# EAGLE design Power Dist MCU (EAGLE 7.2.0)
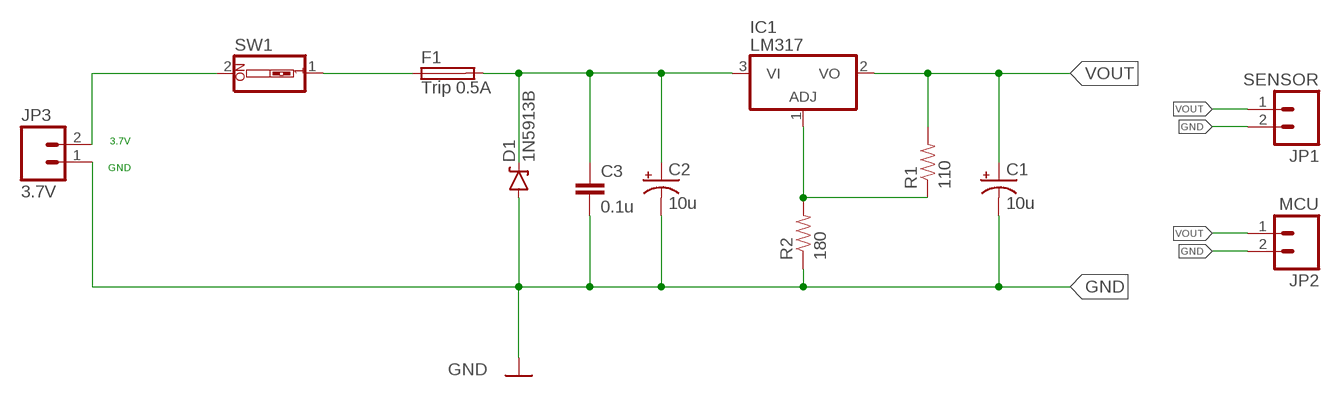
[diagram p0: schematic, sheet 1]

## Parts
C1  10u  CAP_POLPTH2  [CPOL-RADIAL-10UF-25V]
C2  10u  CAP_POLPTH2  [CPOL-RADIAL-10UF-25V]
C3  0.1u  CAPPTH  [CAP-PTH-SMALL]
D1  1N5913B  DIODE-ZENER  [DIODE-BZT52]
F1  Trip 0.5A  PICOFUSE  [PICOFUSE]
IC1  LM317  317T  [TO220H]
JP1  SENSOR  M02PTH  [1X02]
JP2  MCU  M02PTH  [1X02]
JP3  3.7V  M02JST-PTH-2  [JST-2-PTH]
R1  110  RESISTORPTH-1/4W  [AXIAL-0.4]
R2  180  RESISTORPTH-1/4W  [AXIAL-0.4]
SW1  SW_DIP-1  [EDG-01]

## Nets
GND: C1.2(-) C2.2(-) C3.2 D1.A JP1.2 JP2.2 JP3.1 R2.P$1
N$1: F1.1 SW1.1
N$2: JP3.2 SW1.2
N$4: IC1.1(ADJ) R1.P$1 R2.P$2
N$5: C2.1(+) C3.1 D1.C F1.2 IC1.3(VI)
VOUT: C1.1(+) IC1.2(VO) JP1.1 JP2.1 R1.P$2

## Notes on the sheet
- 3.7V
- GND

## Library data of the parts
C1 C2 = SparkFun-Capacitors:CAP_POL: Capacitor Polarized These are standard SMD and PTH capacitors. Normally 10uF, 47uF, and 100uF in electrolytic and tantalum varieties. Always verify the external diameter of the through hole cap, it varies with capacity, voltage, and manufacturer. The EIA devices should be standard.
C3 = SparkFun-Capacitors:CAP: Capacitor Standard 0603 ceramic capacitor, and 0.1" leaded capacitor.
D1 = SparkFun-DiscreteSemi:DIODE-ZENER: Zener Diode Production Part - 8199 3.4V Zener Voltage; PROD-ID: DIO-08199; VALUE: BZT52
F1 = fuse:PICOFUSE: PICOFUSE 19275, Wickmann; OC_FARNELL: unknown; OC_NEWARK: unknown
IC1 = linear:*317: Positive VOLTAGE REGULATOR
JP1 JP2 = SparkFun-Connectors:M02: Standard 2-pin 0.1" header. Use with - straight break away headers ( PRT-00116) - right angle break away headers (PRT-00553) - swiss pins (PRT-00743) - machine pins (PRT-00117) - female headers (PRT-00115) Molex polarized connector foot print use with: PRT-08233 with associated crimp pins and housings. 2.54_SCREWTERM for use with PRT-10571. 3.5mm Screw Terminal footprints for PRT-08084 5mm Screw Terminal footprints for use with PRT-08432
JP3 = SparkFun-Connectors:M02: Standard 2-pin 0.1" header. Use with - straight break away headers ( PRT-00116) - right angle break away headers (PRT-00553) - swiss pins (PRT-00743) - machine pins (PRT-00117) - female headers (PRT-00115) Molex polarized connector foot print use with: PRT-08233 with associated crimp pins and housings. 2.54_SCREWTERM for use with PRT-10571. 3.5mm Screw Terminal footprints for PRT-08084 5mm Screw Terminal footprints for use with PRT-08432; PROD_ID: CONN-09863; SKU: PRT-09914
R1 R2 = SparkFun-Passives:RESISTOR: Resistor Basic schematic elements and footprints for 0603, 1206, and PTH resistors.
SW1 = special:SW_DIP-1: DIP SWITCH

## Board
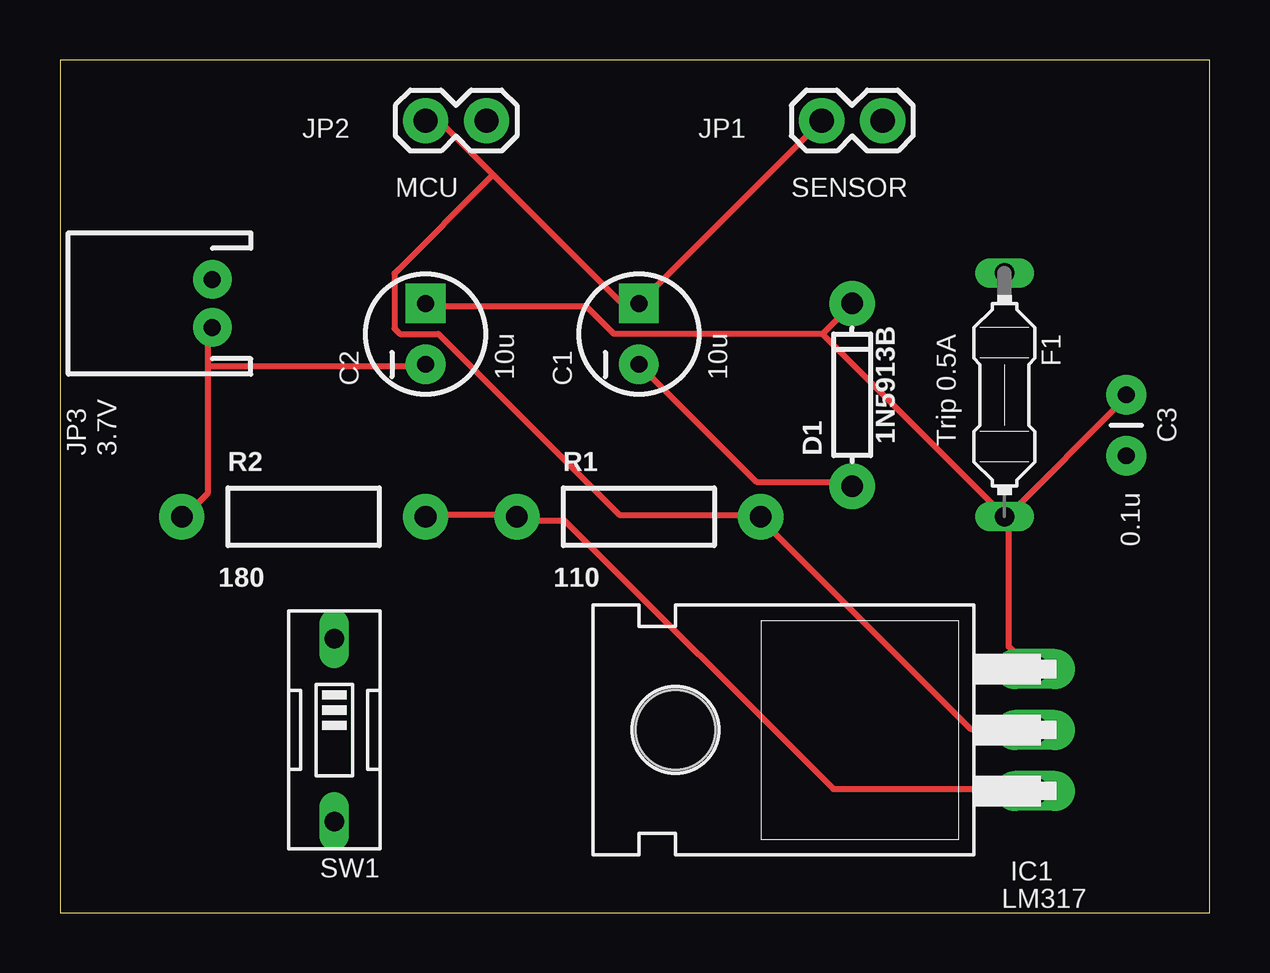
[diagram p1: board, top side]
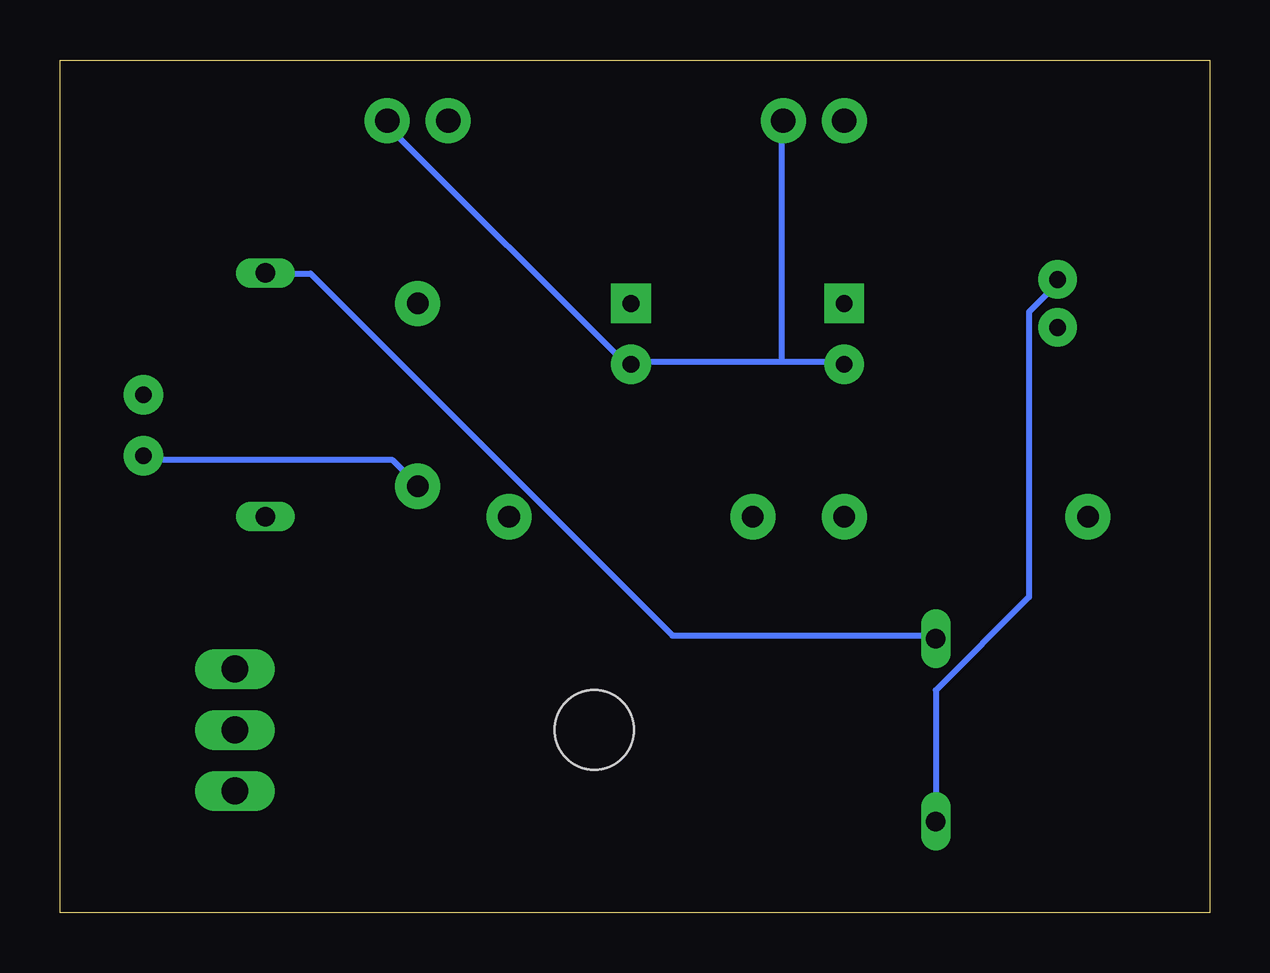
[diagram p2: board, bottom side, seen from below]

Size 47.93 x 35.55 mm. Coordinates in mm from the lower left corner, seen from the top.
Outline: 0,0 47.93,0 47.93,35.55 0,35.55 0,0
Copper layers (1*16): Top 0.0356mm / dielectric 1.5011mm / Bottom 0.0356mm
Design rules "LaenPCBOrder": minimum track width 6mil, minimum drill 13mil, track to track 6mil, track to pad 6mil, pad to pad 6mil, via to via 6mil, smd to smd 6mil, copper to edge 15mil, drill to drill 6mil, minimum pad ring 7mil, minimum via ring 7mil, stop-mask expansion 3mil, vias tented up to drill 0mil, thermal gap 10mil

### Footprints (pad centres in the part's own frame; a part is rotated, then mirrored left to right if it is on the bottom)
CPOL-RADIAL-10UF-25V = drill 0.7 pad 1.651 square: 1 1.27,0 | drill 0.7 pad 1.651: 2 -1.27,0
CAP-PTH-SMALL = drill 0.7 pad 1.651: 1 0,0; 2 2.54,0
DIODE-BZT52 = drill 0.9 pad 1.88: A -3.81,0; C 3.81,0
PICOFUSE = drill 0.813 long: 1 -5.08,0; 2 5.08,0
TO220H = drill 1.118 long: 1 -2.54,-10.16; 2 0,-10.16; 3 2.54,-10.16 | hole 3.302: 0,4.826
1X02 = drill 1.016 pad 1.88: 1 0,0; 2 2.54,0
JST-2-PTH = drill 0.7 pad 1.6: 1 -1,0; 2 1,0
AXIAL-0.4 = drill 0.9 pad 1.88: P$1 -5.08,0; P$2 5.08,0
EDG-01 = drill 0.813 long: 1 0,-3.81; 2 0,3.81

### Placement (x,y rotation side)
C1  24.13,24.13 90 top
C2  15.24,24.13 90 top
C3  44.45,21.59 270 top
D1  33.02,21.59 90 top
F1  39.37,21.59 270 top
IC1  30.48,7.62 90 top
JP1  31.75,33.02 0 top
JP2  15.24,33.02 0 top
JP3  6.35,25.4 90 top
R1  24.13,16.51 0 top
R2  10.16,16.51 0 top
SW1  11.43,7.62 180 top

### Tracks (layer width: path | path; a pad name or v marks a point on that pad's centre or on a via)
GND
  Top 0.254: 6.17,22.76 6.17,17.5 5.26,16.59 R2.P$1 | 6.17,22.76 6.17,24.36 JP3.1 | 6.17,22.76 15.09,22.76 C2.2 | C1.2 29.03,17.96 32.92,17.96 D1.A
  Bottom 0.254: C3.2 44.35,18.87 34.06,18.87 33.15,17.96 D1.A | 17.83,22.99 24,22.99 C1.2 24.23,22.76 34.29,32.82 JP1.2 | 17.83,22.99 15.32,22.99 C2.2 | 17.83,22.99 17.83,32.82 JP2.2
N$1
  Bottom 0.254: SW1.1 11.43,11.56 22.4,11.56 37.49,26.64 39.32,26.64 F1.1
N$2
  Bottom 0.254: SW1.2 11.43,9.27 7.54,13.16 7.54,25.04 6.4,26.19 JP3.2
N$4
  Top 0.254: IC1.1 40.46,5.16 32.23,5.16 21.03,16.36 19.2,16.36 R1.P$1 18.97,16.59 15.32,16.59 R2.P$2
N$5
  Top 0.254: F1.2 39.55,16.36 39.55,11.1 40.46,10.18 IC1.3 | C3.1 44.35,21.39 39.55,16.59 F1.2 | 31.77,24.13 23.09,24.13 21.95,25.27 15.32,25.27 C2.1 | 31.77,24.13 32.92,25.27 D1.C | 31.77,24.13 39.32,16.59 F1.2
VOUT
  Top 0.254: IC1.2 40.46,7.67 37.95,7.67 29.26,16.36 R1.P$2 29.03,16.59 23.32,16.59 15.77,24.13 14.17,24.13 13.95,24.36 13.95,26.64 18.06,30.76 | JP1.1 C1.1 24,25.5 23.32,25.5 18.06,30.76 | 18.06,30.76 16,32.82 15.32,32.82 JP2.1